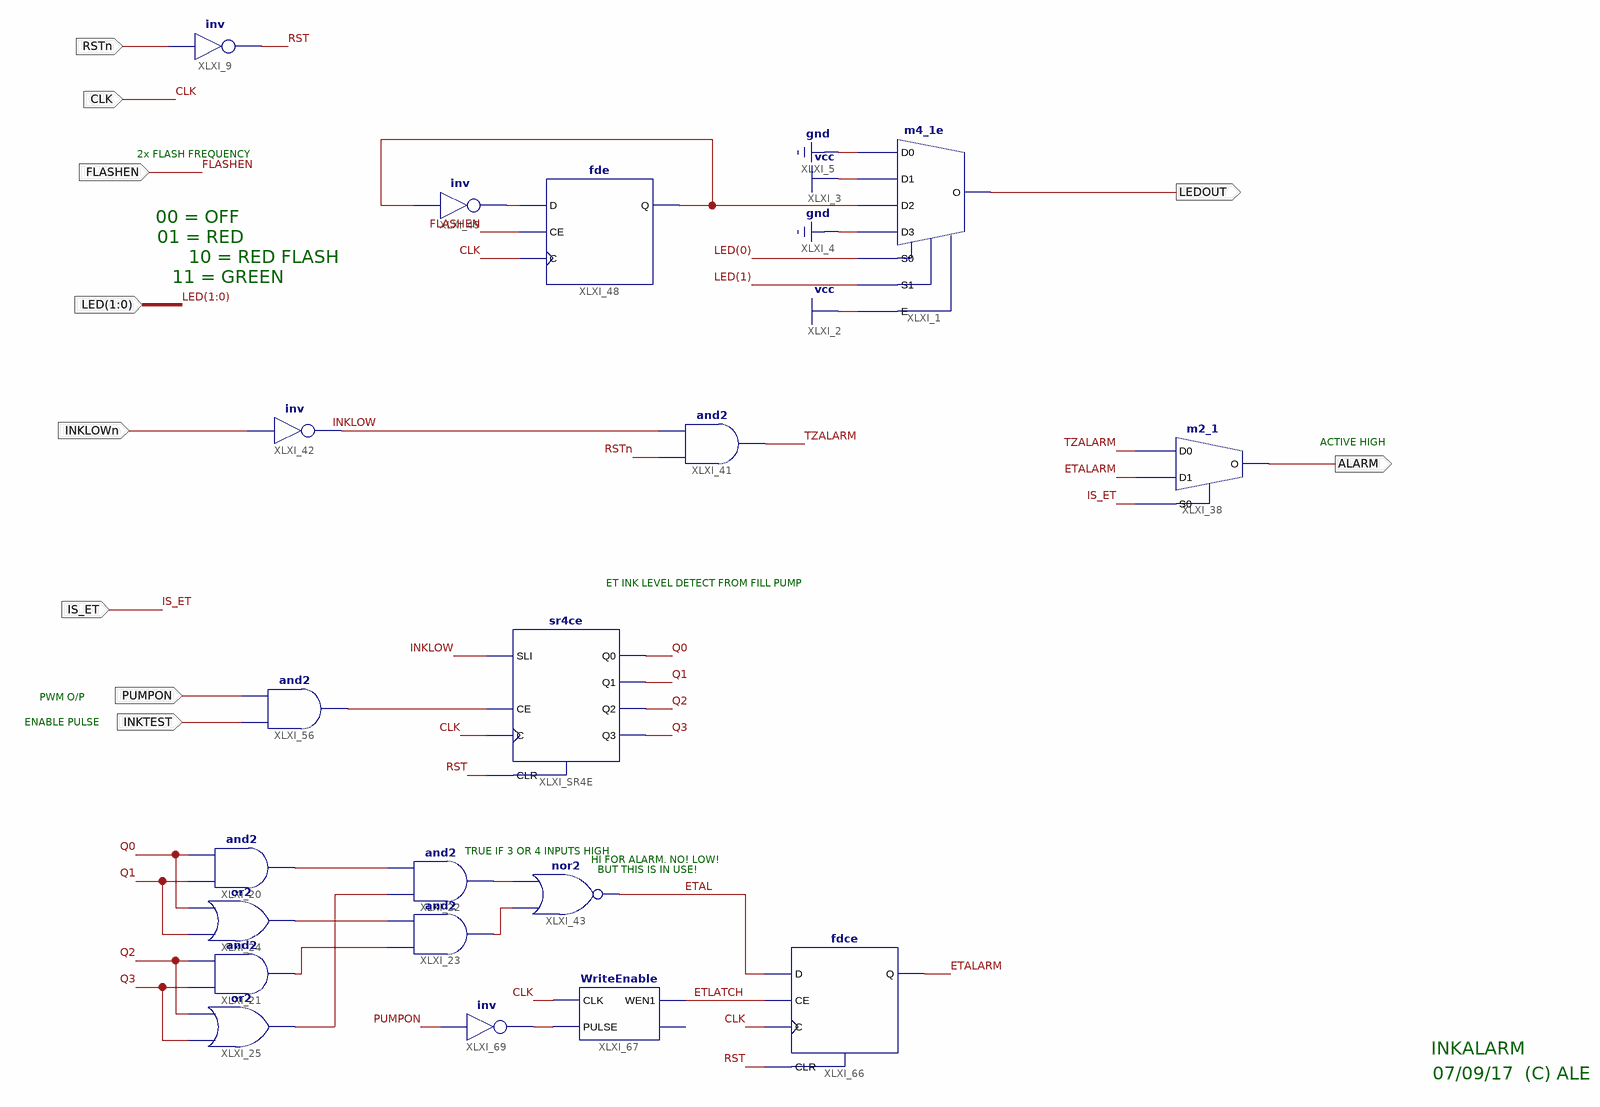
[diagram p0: schematic sheet 1]
// Xilinx ISE schematic DB_InkAlarm.sch (spartan3e) as structural Verilog: 19 symbols, 10 ports
module DB_InkAlarm (
  input  RSTn,
  input  [1:0] LED,
  input  CLK,
  input  FLASHEN,
  input  INKLOWn,
  input  PUMPON,
  input  INKTEST,
  input  IS_ET,
  output LEDOUT,
  output ALARM
);

  wire ETAL, ETALARM, ETLATCH, INKLOW, Q0, Q1, Q2, Q3, RST, TZALARM, XLXN_45, XLXN_47, XLXN_49, XLXN_52,
       XLXN_53, XLXN_54, XLXN_115, XLXN_116, XLXN_134, XLXN_154;

  m4_1e XLXI_1 (.D0(1'b0), .D1(1'b1), .D2(XLXN_116), .D3(1'b0), .E(1'b1), .S0(LED[0]), .S1(LED[1]), .O(LEDOUT));
  not XLXI_9 (RST, RSTn);
  fde XLXI_48 (.C(CLK), .CE(FLASHEN), .D(XLXN_115), .Q(XLXN_116));
  not XLXI_49 (XLXN_115, XLXN_116);
  not XLXI_42 (INKLOW, INKLOWn);
  or XLXI_24 (XLXN_53, Q1, Q0);
  and XLXI_20 (XLXN_45, Q1, Q0);
  and XLXI_22 (XLXN_49, XLXN_52, XLXN_45);
  and XLXI_21 (XLXN_47, Q3, Q2);
  or XLXI_25 (XLXN_52, Q3, Q2);
  and XLXI_23 (XLXN_54, XLXN_47, XLXN_53);
  fdce XLXI_66 (.C(CLK), .CE(ETLATCH), .CLR(RST), .D(ETAL), .Q(ETALARM));
  not XLXI_69 (XLXN_154, PUMPON);
  WriteEnable XLXI_67 (.CLK(CLK), .PULSE(XLXN_154), .WEN1(ETLATCH));  // open: WEN0
  and XLXI_56 (XLXN_134, INKTEST, PUMPON);
  sr4ce XLXI_SR4E (.C(CLK), .CE(XLXN_134), .CLR(RST), .SLI(INKLOW), .Q0(Q0), .Q1(Q1), .Q2(Q2), .Q3(Q3));
  and XLXI_41 (TZALARM, RSTn, INKLOW);
  m2_1 XLXI_38 (.D0(TZALARM), .D1(ETALARM), .S0(IS_ET), .O(ALARM));
  nor XLXI_43 (ETAL, XLXN_54, XLXN_49);

  // Notes on the sheet:
  //   2x FLASH FREQUENCY
  //   00 = OFF
  //   01 = RED
  //   10 = RED FLASH
  //   11 = GREEN
  //   ACTIVE HIGH
  //   ET INK LEVEL DETECT FROM FILL PUMP
  //   PWM O/P
  //   ENABLE PULSE
  //   TRUE IF 3 OR 4 INPUTS HIGH
  //   HI FOR ALARM. NO! LOW!
  //   BUT THIS IS IN USE!
  //   INKALARM
  //   07/09/17  (C) ALE
endmodule
